# EAGLE design STl-Link-V10-final (EAGLE 6.3)
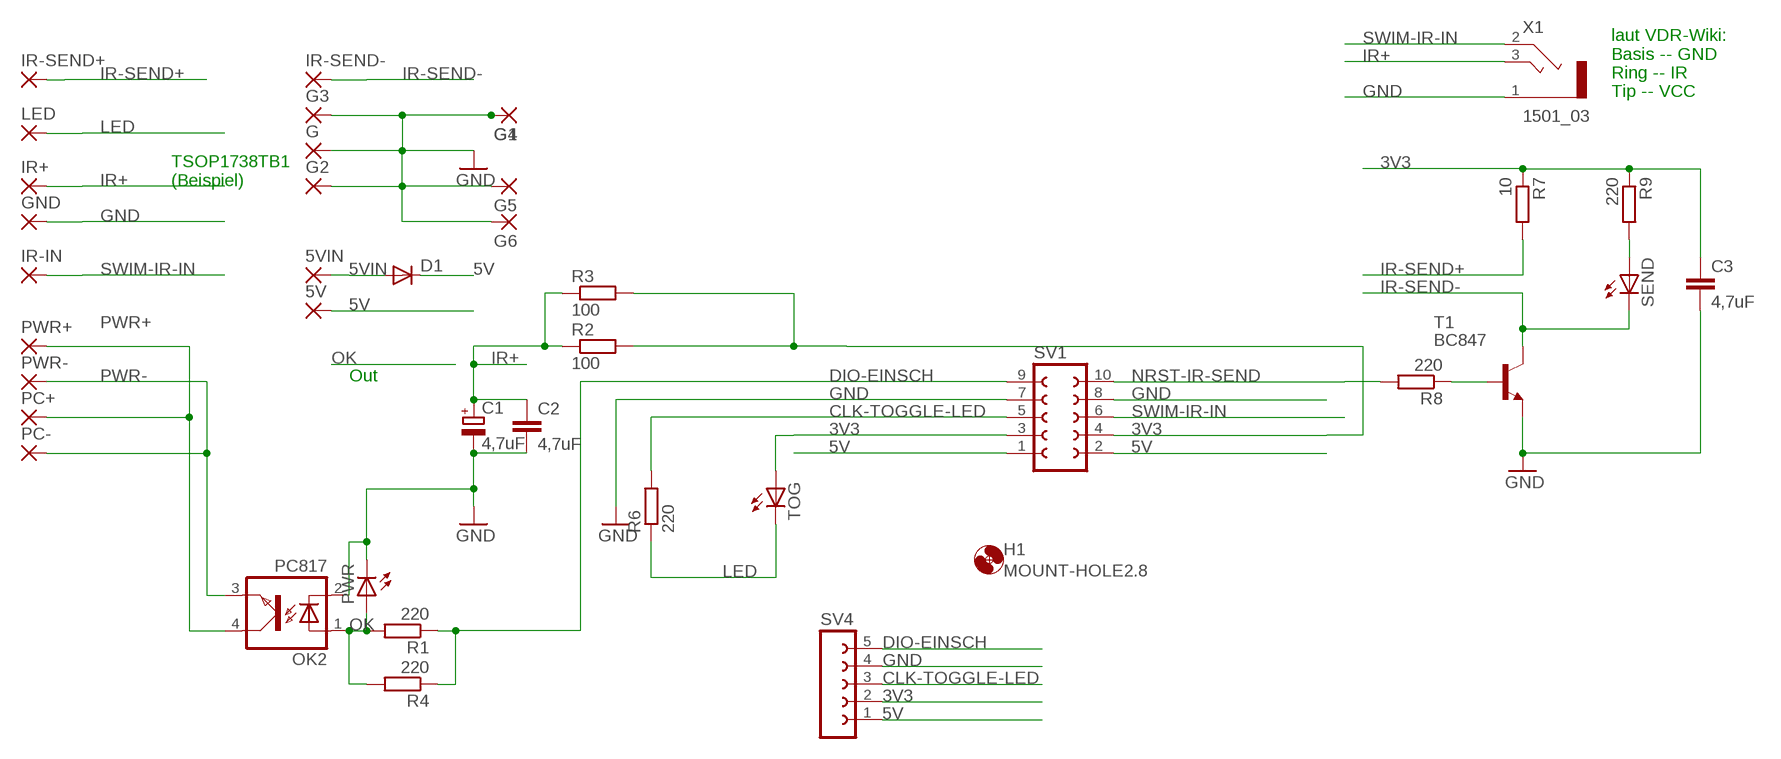
[diagram p0: schematic, sheet 1]

## Parts
5V  SMD2  [SMD1,27-2,54]
5VIN  SMD2  [SMD1,27-2,54]
C1  4,7uF  CPOL-EUE1.8-4  [E1,8-4]
C2  4,7uF  C-EUC1206K  [C1206K]
C3  4,7uF  C-EUC1206K  [C1206K]
D1  DIODE-SOD123  [SOD123]
G  SMD2  [SMD1,27-2,54]
G1  SMD2  [SMD1,27-2,54]
G2  SMD2  [SMD1,27-2,54]
G3  SMD2  [SMD1,27-2,54]
G4  SMD2  [SMD1,27-2,54]
G5  SMD2  [SMD1,27-2,54]
G6  SMD2  [SMD1,27-2,54]
GND  SMD2  [SMD1,27-2,54]
H1  MOUNT-HOLE2.8  [2,8]
IR+  SMD2  [SMD1,27-2,54]
IR-IN  SMD2  [SMD1,27-2,54]
IR-SEND+  SMD2  [SMD1,27-2,54]
IR-SEND-  SMD2  [SMD1,27-2,54]
LED  SMD2  [SMD1,27-2,54]
OK2  PC817  [DIL04]
PC+  SMD2  [SMD1,27-2,54]
PC-  SMD2  [SMD1,27-2,54]
PWR  LEDCHIPLED_1206  [CHIPLED_1206]
PWR+  SMD2  [SMD1,27-2,54]
PWR-  SMD2  [SMD1,27-2,54]
R1  220  R-EU_0204/7  [0204/7]
R2  100  R-EU_0204/7  [0204/7]
R3  100  R-EU_R0805W  [R0805W]
R4  220  R-EU_R0805W  [R0805W]
R6  220  R-EU_R0805W  [R0805W]
R7  10  R-EU_R0805W  [R0805W]
R8  220  R-EU_R0805W  [R0805W]
R9  220  R-EU_R0805W  [R0805W]
SEND  LEDCHIPLED_1206  [CHIPLED_1206]
SV1  FE05-2  [FE05-2]
SV4  FE05-1  [FE05-1]
T1  BC847  [SOT23]
TOG  LEDCHIPLED_1206  [CHIPLED_1206]
X1  1501_03  [1501_03]

## Nets
3V3: C3.1 R2.2 R3.2 R7.1 R9.1 SV1.3 SV1.4 SV4.2 TOG.A
5V: 5V.1(P) D1.C SV1.1 SV1.2 SV4.1
5VIN: 5VIN.1(P) D1.A
CLK-TOGGLE-LED: R6.2 SV1.5 SV4.3
DIO-EINSCH: R1.1 R4.1 SV1.9 SV4.5
GND: C1.- C2.2 C3.2 G1.1(P) G2.1(P) G3.1(P) G4.1(P) G5.1(P) G6.1(P) G.1(P) GND.1(P) OK2.2(C) PWR.C SV1.7 SV1.8 SV4.4 T1.2(E) X1.1
IR+: C1.+ C2.1 IR+.1(P) R2.1 R3.1 X1.3
IR-SEND+: IR-SEND+.1(P) R7.2
IR-SEND-: IR-SEND-.1(P) SEND.C T1.3(C)
LED: LED.1(P) R6.1 TOG.C
N$1: R9.2 SEND.A
N$3: R8.1 T1.1(B)
NRST-IR-SEND: R8.2 SV1.10
OK: OK2.1(A) PWR.A R1.2 R4.2
PWR+: OK2.4(COL) PC+.1(P) PWR+.1(P)
PWR-: OK2.3(EMIT) PC-.1(P) PWR-.1(P)
SWIM-IR-IN: IR-IN.1(P) SV1.6 X1.2

## Notes on the sheet
- laut VDR-Wiki:
  Basis -- GND
  Ring -- IR
  Tip -- VCC
- TSOP1738TB1
  (Beispiel)
- Out

## Library data of the parts
5V 5VIN G G1-G6 GND IR+ IR-IN IR-SEND+ IR-SEND- LED PC+ PC- PWR+ PWR- = wirepad:SMD2: SMD PAD
C1 = rcl:CPOL-EU: POLARIZED CAPACITOR, European symbol
C2 C3 = rcl:C-EU: CAPACITOR, European symbol
D1 = diode:DIODE-: DIODE
H1 = holes:MOUNT-HOLE: MOUNTING HOLE with drill center marker
OK2 = optocoupler:PC817: SHARP OPTO COUPLER; MPN: PC817X4J000F; OC_FARNELL: 9707727; OC_NEWARK: 97K7059
PWR SEND TOG = led:LED: LED OSRAM: - CHIPLED LG R971, LG N971, LY N971, LG Q971, LY Q971, LO R971, LY R971 LH N974, LH R974 LS Q976, LO Q976, LY Q976 LO Q996 - Hyper CHIPLED LW Q18S LB Q993, LB Q99A, LB R99A - SideLED LS A670, LO A670, LY A670, LG A670, LP A670 LB A673, LV A673, LT A673, LW A673 LH A674 LY A675 LS A676, LA A676, LO A676, LY A676, LW A676 LS A679, LY A679, LG A679 - Hyper Micro SIDELED® LS Y876, LA Y876, LO Y876, LY Y876 LT Y87S - SmartLED LW L88C, LW L88S LB L89C, LB L89S, LG L890 LS L89K, LO L89K, LY L89K LS L896, LA L896, LO L896, LY L896 - TOPLED LS T670, LO T670, LY T670, LG T670, LP T670 LSG T670, LSP T670, LSY T670, LOP T670, LYG T670 LG T671, LOG T671, LSG T671 LB T673, LV T673, LT T673, LW T673 LH T674 LS T676, LA T676, LO T676, LY T676, LB T676, LH T676, LSB T676, LW T676 LB T67C, LV T67C, LT T67C, LS T67K, LO T67K, LY T67K, LW E67C LS E67B, LA E67B, LO E67B, LY E67B, LB E67C, LV E67C, LT E67C LW T67C LS T679, LY T679, LG T679 LS T770, LO T770, LY T770, LG T770, LP T770 LB T773, LV T773, LT T773, LW T773 LH T774 LS E675, LA E675, LY E675, LS T675 LS T776, LA T776, LO T776, LY T776, LB T776 LHGB T686 LT T68C, LB T68C - Hyper Mini TOPLED® LB M676 - Mini TOPLED Santana® LG M470 LS M47K, LO M47K, LY M47K Source: http://www.osram.convergy.de LUXEON: - LUMILED® LXK2-PW12-R00, LXK2-PW12-S00, LXK2-PW14-U00, LXK2-PW14-V00 LXK2-PM12-R00, LXK2-PM12-S00, LXK2-PM14-U00 LXK2-PE12-Q00, LXK2-PE12-R00, LXK2-PE12-S00, LXK2-PE14-T00, LXK2-PE14-U00 LXK2-PB12-K00, LXK2-PB12-L00, LXK2-PB12-M00, LXK2-PB14-N00, LXK2-PB14-P00, LXK2-PB14-Q00 LXK2-PR12-L00, LXK2-PR12-M00, LXK2-PR14-Q00, LXK2-PR14-R00 LXK2-PD12-Q00, LXK2-PD12-R00, LXK2-PD12-S00 LXK2-PH12-R00, LXK2-PH12-S00 LXK2-PL12-P00, LXK2-PL12-Q00, LXK2-PL12-R00 Source: www.luxeon.com KINGBRIGHT: KA-3528ASYC Source: www.kingbright.com
R1-R4 R6-R9 = rcl:R-EU_: RESISTOR, European symbol
SV1 = con-lsta:FE05-2: FEMALE HEADER; OC_FARNELL: unknown; OC_NEWARK: unknown
SV4 = con-lsta:FE05-1: FEMALE HEADER; OC_FARNELL: unknown; OC_NEWARK: unknown
T1 = transistor:BC847: NPN TRANSISTOR
X1 = con-lumberg:1501_03: Klinkensteckverbinder nach JISC 6560, 2,5 mm Jack connectors according to JISC 6560, 2.5 mm Source: http://www.lumberg.com/Produkte/PDFs/1501_03.pdf; OC_FARNELL: 1200127; OC_NEWARK: unknown

## Net classes
0 default: width 0.406 mm

## Board
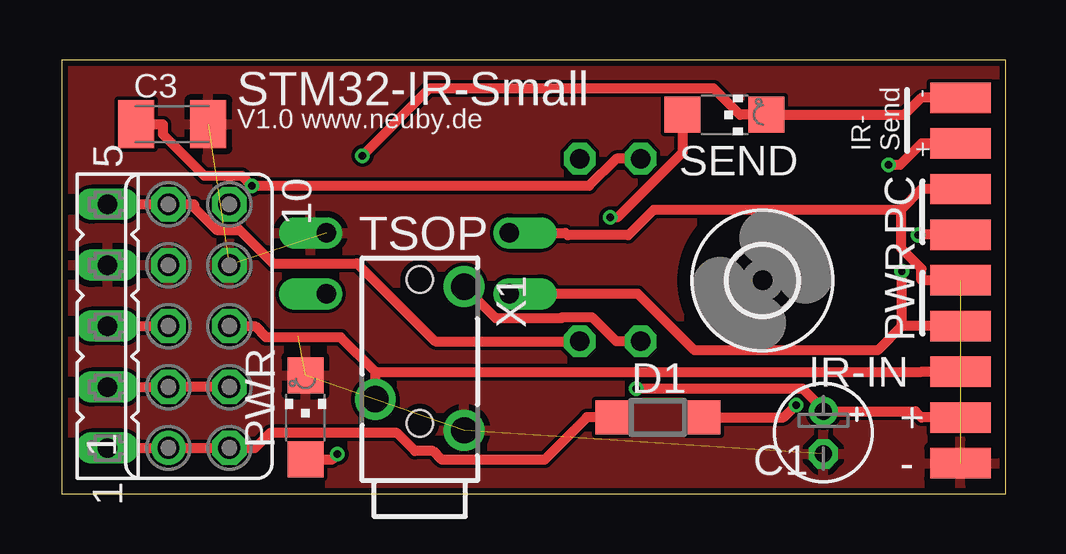
[diagram p1: board, top side]
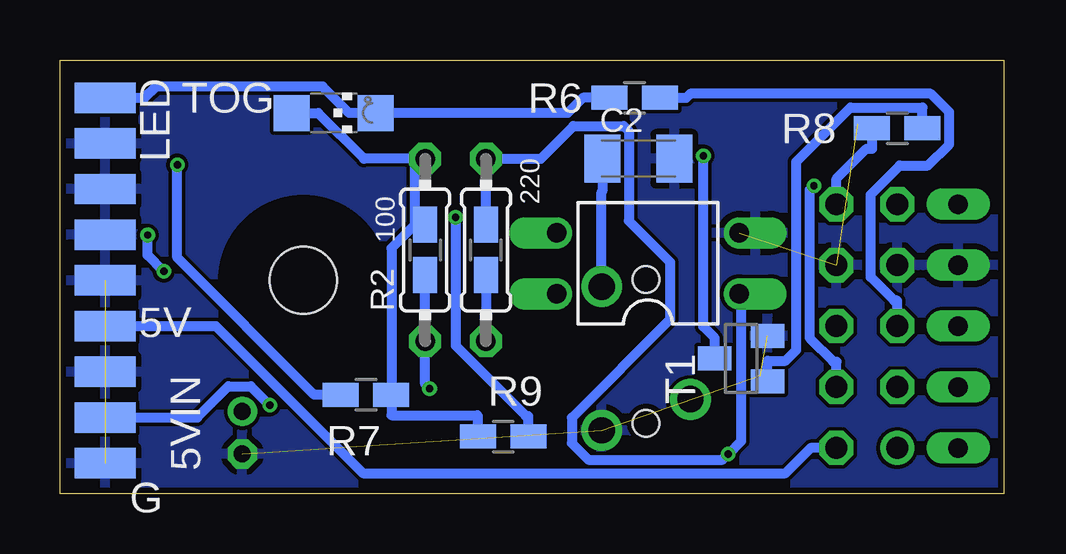
[diagram p2: board, bottom side, seen from below]

Size 39.35 x 18.09 mm. Coordinates in mm from the lower left corner, seen from the top.
Outline: 0,0 39.35,0 39.35,18.09 0,18.09 0,0
Copper layers (1*16): Top 0.035mm / dielectric 1.5mm / Bottom 0.035mm
Design rules "Fusion_eagle_rule_v1.1": minimum track width 6mil, minimum drill 12mil, track to track 6mil, track to pad 6mil, pad to pad 6mil, via to via 6mil, smd to smd 0mil, copper to edge 10mil, drill to drill 10mil, minimum pad ring 10mil, minimum via ring 6mil, stop-mask expansion 2mil, vias tented up to drill 100mil, thermal gap 10mil

### Footprints (pad centres in the part's own frame; a part is rotated, then mirrored left to right if it is on the bottom)
SMD1,27-2,54 = smd 1.27 x 2.54: 1 0,0
E1,8-4 = drill 0.711 pad 1.168: + -0.889,0 | drill 0.711 pad 1.168 octagon: - 0.889,0
C1206K = smd 1.5 x 2: 1 -1.5,0; 2 1.5,0
SOD123 = smd 1.4 x 1.4: A 1.9,0; C -1.9,0
2,8 = hole 2.8: 0,0
DIL04 = drill 0.813 offset: 1 -1.27,-3.81; 2 1.27,-3.81; 3 1.27,3.81; 4 -1.27,3.81
CHIPLED_1206 = smd 1.5 x 1.5: A 0,-1.75; C 0,1.75
0204/7 = drill 0.813 octagon: 1 -3.81,0; 2 3.81,0
R0805W = smd 1.5 x 1: 1 -1.052,0; 2 1.052,0
FE05-2 = drill 0.914: 1 -5.08,1.27 | drill 0.914 octagon: 2 -5.08,-1.27; 3 -2.54,1.27; 4 -2.54,-1.27; 5 0,1.27; 6 0,-1.27; 7 2.54,1.27; 8 2.54,-1.27; 9 5.08,1.27; 10 5.08,-1.27
FE05-1 = drill 0.813 long: 1 -5.08,0; 2 -2.54,0; 3 0,0; 4 2.54,0; 5 5.08,0
SOT23 = smd 1 x 1.4: 1 -0.95,-1.1; 2 0.95,-1.1; 3 0,1.1
1501_03 = drill 1.1 pad 1.7: 1 -1.85,0.3; 2 1.85,-1; 3 -1.85,-5.7 | hole 1.1: 0,0; 0,-6

### Placement (x,y rotation side)
5V  37.47,6.99 270 bottom
5VIN  37.47,3.17 90 bottom
C1  31.75,2.54 270 top
C2  15.24,13.97 0 bottom
C3  4.61,15.4 0 top
D1  24.84,3.18 0 top
G  37.47,1.27 90 bottom
G1  37.47,8.89 270 bottom
G2  37.47,1.27 90 bottom
G3  37.47,5.08 90 bottom
G4  37.47,10.79 270 bottom
G5  37.47,12.7 270 bottom
G6  37.47,14.61 90 bottom
GND  37.47,1.27 90 top
H1  29.21,8.89 0 top
IR+  37.47,3.17 90 top
IR-IN  37.47,5.08 90 top
IR-SEND+  37.47,14.61 90 top
IR-SEND-  37.47,16.51 90 top
LED  37.47,16.51 270 bottom
OK2  14.84,9.61 90 bottom
PC+  37.47,10.79 90 top
PC-  37.47,12.7 90 top
PWR  10.16,3.17 0 top
PWR+  37.47,6.99 90 top
PWR-  37.47,8.89 90 top
R1  21.59,10.16 90 bottom
R2  24.13,10.16 90 bottom
R3  24.13,10.16 90 bottom
R4  21.59,10.16 90 bottom
R6  15.4,16.51 0 bottom
R7  26.59,4.12 180 bottom
R8  4.45,15.24 180 bottom
R9  20.88,2.38 0 bottom
SEND  27.62,15.79 270 top
SV1  5.71,6.99 90 top
SV4  1.91,6.99 90 top
T1  10.96,5.63 90 bottom
TOG  27.94,15.88 270 bottom
X1  14.92,2.94 180 top

### Tracks (layer width: path | path; a pad name or v marks a point on that pad's centre or on a via)
3V3  (via drill 0.3 pad 0.61)
  Top 0.406: R2.2 23.11,13.97 21.98,12.84 v7.92,12.84 7.51,13.25 5.94,13.25 4.21,14.98 4.21,15.4 C3.1 | SV1.4 SV1.3 SV4.2
  Bottom 0.406: 24.56,11.21 25.54,10.23 R7.1 25.54,3.27 21.96,3.27 21.93,3.24 R9.1 | 24.56,11.21 24.56,13.97 | SV1.4 6.98,5.51 7.12,5.51 8.1,6.5 8.1,12.66 v7.92,12.84 | 24.56,13.97 26.68,13.97 28.58,15.88 TOG.A | R2.2 24.56,13.97 | R3.2 24.56,11.21
5V
  Top 0.406: D1.C 21.89,3.18 20.12,1.41 15.84,1.41 15.47,1.78 14.72,1.78 13.97,2.53 8.68,2.53 8.05,1.91 SV1.2 SV1.1 SV4.1
  Bottom 0.406: 5V.1 32.85,6.99 26.72,0.85 9.11,0.85 8.05,1.91 SV1.2
5VIN  (via drill 0.3 pad 0.61)
  Top 0.406: D1.A 30.1,3.18 v30.61,3.69
  Bottom 0.406: 5VIN.1 33.63,3.17 32.33,4.47 31.39,4.47 v30.61,3.69
CLK-TOGGLE-LED
  Top 0.406: SV4.3 SV1.5
  Bottom 0.406: R6.2 13.24,16.51 13.08,16.67 3.05,16.67 2.29,15.91 2.29,14.56 3.17,13.68 4.34,13.68 5.55,12.47 5.55,9.03 4.58,8.05 4.45,8.05 SV1.5
DIO-EINSCH
  Top 0.406: R1.1 15.56,6.35 12.31,9.61 8.81,9.61 7.41,11 6.45,11 5.51,11.93 5.51,12.06 SV1.9 SV4.5
  Bottom 0.406: R4.1 R1.1
GND  (7 unrouted)
  pour Top: 0,18.41 0,0 39.37,0 39.37,17.78
  pour Bottom: 0,0 39.37,0 39.37,17.78 0,18.41
IR+  (via drill 0.3 pad 0.61)
  Top 0.406: v23.94,4.38 30.88,4.38 31.75,3.51 C1.+ 35.59,3.43 35.84,3.17 IR+.1 | R2.1 23.11,6.35 22.1,7.37 20.87,7.37 20.82,7.32 18.09,7.32 X1.3
  Bottom 0.406: R3.1 R2.1 24.13,4.57 v23.94,4.38 | C2.1 16.74,12.61 16.77,12.58 X1.3
IR-SEND+  (via drill 0.3 pad 0.61)
  Top 0.406: IR-SEND+.1 35.84,14.61 34.95,13.71 v34.46,13.71
  Bottom 0.406: R7.2 28.75,4.12 34.46,9.84 v34.46,13.71
IR-SEND-  (via drill 0.3 pad 0.61)
  Top 0.406: v12.53,14.09 15.34,16.9 27.16,16.9 28.27,15.79 SEND.C 35.12,15.79 35.84,16.51 IR-SEND-.1
  Bottom 0.406: T1.3 12.05,6.49 12.53,6.96 v12.53,14.09
LED
  Bottom 0.406: LED.1 35.84,16.51 35.37,16.98 28.4,16.98 27.3,15.88 TOG.C 18.19,15.88 17.56,16.51 R6.1
N$1  (via drill 0.3 pad 0.61)
  Top 0.406: SEND.A 25.88,14.23 23.16,11.52 v22.86,11.52
  Bottom 0.406: R9.2 19.82,3.24 19.93,3.24 22.86,6.17 v22.86,11.52
N$3
  Bottom 0.406: R8.1 3.39,16.1 6.4,16.1 8.66,13.84 8.66,5.99 9.11,5.54 9.86,5.54 T1.1
NRST-IR-SEND
  Bottom 0.406: R8.2 5.5,14.38 5.73,14.38 6.98,13.13 SV1.10
OK  (via drill 0.3 pad 0.61)
  Top 0.406: PWR.A 11.27,1.43 v11.49,1.65
  Bottom 0.406: OK2.1 10.96,8.26 10.96,2.18 v11.49,1.65 11.73,1.41 17.32,1.41 18.02,2.1 18.02,3.17 13.91,7.27 13.91,9.65 15.63,11.38 15.63,15.12 15.84,15.33 17.95,15.33 19.31,13.97 R1.2 R4.2
PWR+  (via drill 0.3 pad 0.61)
  Top 0.406: 35.02,6.99 34.01,5.98 26.37,5.98 24.01,8.34 OK2.4 | PWR+.1 35.02,6.99 | 35.02,6.99 v35.02,9.27 | PC+.1 35.84,10.79 35.83,10.78 v35.7,10.78
  Bottom 0.406: v35.02,9.27 35.7,9.95 v35.7,10.78
PWR-
  Top 0.406: 34.99,11.83 34.99,10.23 35.84,9.38 35.84,8.89 PWR-.1 | 34.99,11.83 34.99,11.86 35.84,12.7 PC-.1 | 34.99,11.83 24.66,11.83 23.61,10.78 21.08,10.78 20.99,10.88 OK2.3
SWIM-IR-IN
  Top 0.406: 13.07,5.08 11.63,6.52 8.52,6.52 8.05,6.99 SV1.6 | X1.2 13.07,5.08 | 13.07,5.08 35.84,5.08 IR-IN.1

### Text on the board
tNames: - | STM32-IR-Small | V1.0 www.neuby.de | IR- / Send | + | PC | TSOP | PWR | IR-IN | + | -
bNames: 220 | 100
bValues: STM-IRMP V1.0 | www.neuby.de